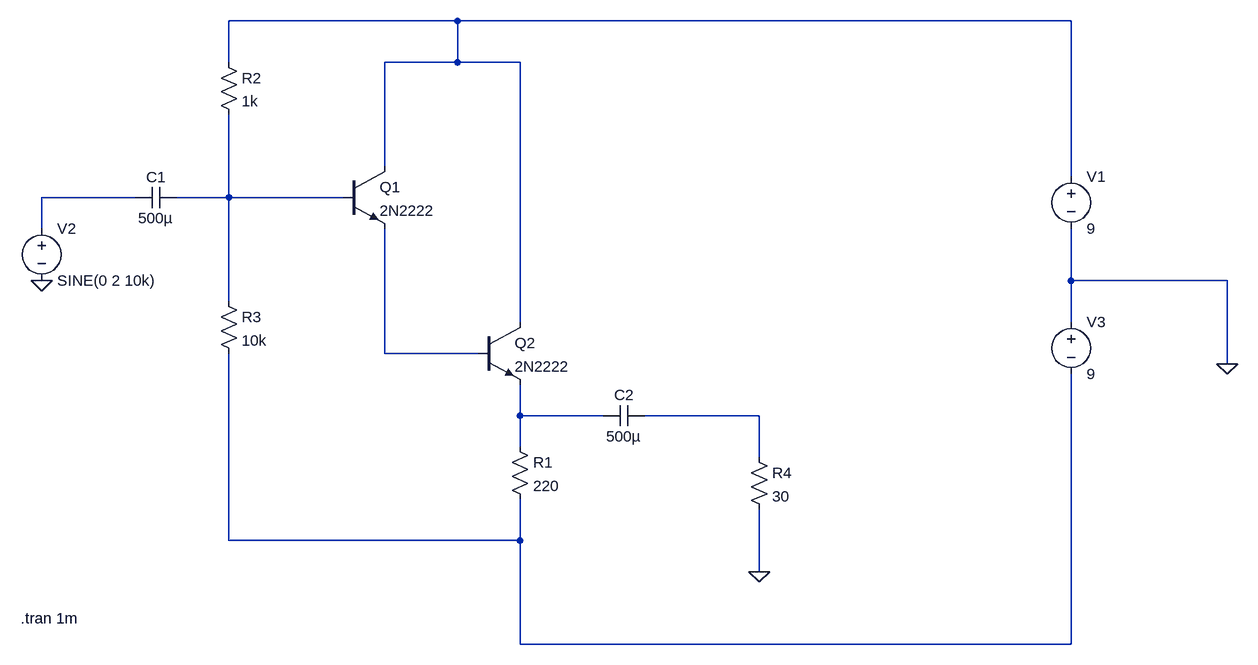
[diagram p0: schematic output_v2_darlington.asc]
output_v2_darlington.asc, the LTspice schematic file:
Version 4
SHEET 1 1588 772
WIRE 384 -192 32 -192
WIRE 1328 -192 384 -192
WIRE 32 -128 32 -192
WIRE 384 -128 384 -192
WIRE 384 -128 272 -128
WIRE 480 -128 384 -128
WIRE 272 32 272 -128
WIRE 1328 48 1328 -192
WIRE -112 80 -256 80
WIRE 32 80 32 -48
WIRE 32 80 -48 80
WIRE 208 80 32 80
WIRE -256 128 -256 80
WIRE 1328 208 1328 128
WIRE 1568 208 1328 208
WIRE 32 240 32 80
WIRE 480 272 480 -128
WIRE 1328 272 1328 208
WIRE 272 320 272 128
WIRE 416 320 272 320
WIRE 1568 336 1568 208
WIRE 480 416 480 368
WIRE 608 416 480 416
WIRE 848 416 672 416
WIRE 480 464 480 416
WIRE 848 480 848 416
WIRE 32 608 32 320
WIRE 480 608 480 544
WIRE 480 608 32 608
WIRE 848 656 848 560
WIRE 480 768 480 608
WIRE 1328 768 1328 352
WIRE 1328 768 480 768
FLAG -256 208 0
FLAG 848 656 0
FLAG 1568 336 0
SYMBOL npn 208 32 R0
SYMATTR InstName Q1
SYMATTR Value 2N2222
SYMBOL npn 416 272 R0
SYMATTR InstName Q2
SYMATTR Value 2N2222
SYMBOL res 464 448 R0
SYMATTR InstName R1
SYMATTR Value 220
SYMBOL res 16 -144 R0
SYMATTR InstName R2
SYMATTR Value 1k
SYMBOL res 16 224 R0
SYMATTR InstName R3
SYMATTR Value 10k
SYMBOL voltage -256 112 R0
WINDOW 123 0 0 Left 0
WINDOW 39 0 0 Left 0
SYMATTR InstName V2
SYMATTR Value SINE(0 2 10k)
SYMBOL cap 672 400 R90
WINDOW 0 0 32 VBottom 2
WINDOW 3 32 32 VTop 2
SYMATTR InstName C2
SYMATTR Value 500µ
SYMBOL res 832 464 R0
SYMATTR InstName R4
SYMATTR Value 30
SYMBOL voltage 1328 32 R0
WINDOW 123 0 0 Left 0
WINDOW 39 0 0 Left 0
SYMATTR InstName V1
SYMATTR Value 9
SYMBOL voltage 1328 256 R0
WINDOW 123 0 0 Left 0
WINDOW 39 0 0 Left 0
SYMATTR InstName V3
SYMATTR Value 9
SYMBOL cap -48 64 R90
WINDOW 0 0 32 VBottom 2
WINDOW 3 32 32 VTop 2
SYMATTR InstName C1
SYMATTR Value 500µ
TEXT -288 728 Left 2 !.tran 1m

The netlist it stands for:
* output_v2_darlington.asc
Q1 N001 N003 N004 0 2N2222
Q2 N001 N004 N005 0 2N2222
R1 N005 N007 220
R2 N001 N003 1k
R3 N003 N007 10k
V2 N002 0 SINE(0 2 10k)
C2 N006 N005 500µ
R4 N006 0 30
V1 N001 0 9
V3 0 N007 9
C1 N003 N002 500µ
.model NPN NPN
.model PNP PNP
.lib standard.bjt
.tran 1m
.backanno
.end